# EAGLE design dcboard (EAGLE 8.4.3)
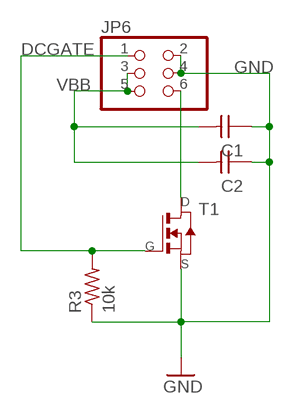
[diagram p0: schematic, sheet 1]

## Parts
C1  CAP-UNPOLARIZEDFAB  [C1206FAB]
C2  CAP-UNPOLARIZEDFAB  [C1206FAB]
JP6  PINHD-2X3-SMD  [2X03SMD]
R3  10k  RES-US1206FAB  [R1206FAB]
T1  NMOSFETSOT23  [SOT-23]

## Nets
DCGATE: JP6.1 R3.2 T1.3(G)
GND: C1.1 C2.1 JP6.2 JP6.4 R3.1 T1.2(S)
N$1: JP6.6 T1.1(D)
VBB: C1.2 C2.2 JP6.3 JP6.5

## Library data of the parts
C1 C2 = fab:CAP-UNPOLARIZED
JP6 = fab:PINHD-2X3-SMD: PIN HEADER
R3 = fab:RES-US: Resistor (US Symbol) Variants with postfix FAB are widened to allow the routing of internal traces
T1 = fab:NMOSFET: MOS FET

## Board
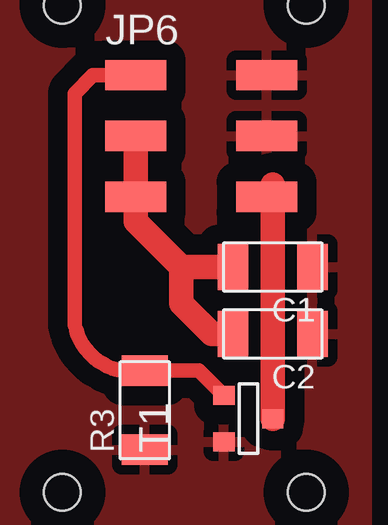
[diagram p1: board, top side]

No outline drawn. Coordinates in mm, seen from the top.
Copper layers (1*16): Top 0.035mm / dielectric 1.5mm / Bottom 0.035mm
Design rules "fab *": minimum track width 0.3mm, minimum drill 32mil, track to track 0.397mm, track to pad 0.397mm, pad to pad 0.397mm, via to via 0.397mm, smd to smd 0.397mm, copper to edge 40mil, drill to drill 16mil, minimum pad ring 10mil, minimum via ring 8mil, stop-mask expansion 4mil, vias tented up to drill 0mil, thermal gap 16mil
Holes 1.52 mm at 2.54,22.86 2.54,2.54 12.7,2.54 12.7,22.86

### Footprints (pad centres in the part's own frame; a part is rotated, then mirrored left to right if it is on the bottom)
C1206FAB = smd 1.27 x 1.905: 1 -1.651,0; 2 1.651,0
2X03SMD = smd 2.54 x 1.27: 1 -2.54,2.54; 2 2.92,2.54; 3 -2.54,0; 4 2.92,0; 5 -2.54,-2.54; 6 2.92,-2.54
R1206FAB = smd 1.27 x 1.905: 1 -1.651,0; 2 1.651,0
SOT-23 = smd 0.787 x 0.889: 1 0.025,-1.016; 2 -0.94,1.016; 3 0.991,1.016

### Placement (x,y rotation side)
C1  11.3,11.94 180 top
C2  11.3,9.14 180 top
JP6  8.13,17.4 0 top
R3  5.97,5.97 90 top
T1  10.29,5.59 90 top

### Tracks (layer width: path | path; a pad name or v marks a point on that pad's centre or on a via)
DCGATE
  Top 0.61: JP6.1 3.81,19.94 3.05,19.18 3.05,9.53 arc90 R3.2 8.23,7.62 T1.3
GND
  pour Top (isolate 0.813): 15.24,25.4 0,25.4 0,0 15.24,0
N$1
  Top 0.3: 11.3,15.37 JP6.6
  Top 1.016: T1.1 11.3,15.37
VBB
  Top 1.016: JP6.3 JP6.5 5.59,13.84 7.49,11.94 | 7.49,11.94 C1.2 | C2.2 8.76,9.14 7.49,10.41 7.49,11.94